# EAGLE schematic MicroMouse (EAGLE 8.4.3)
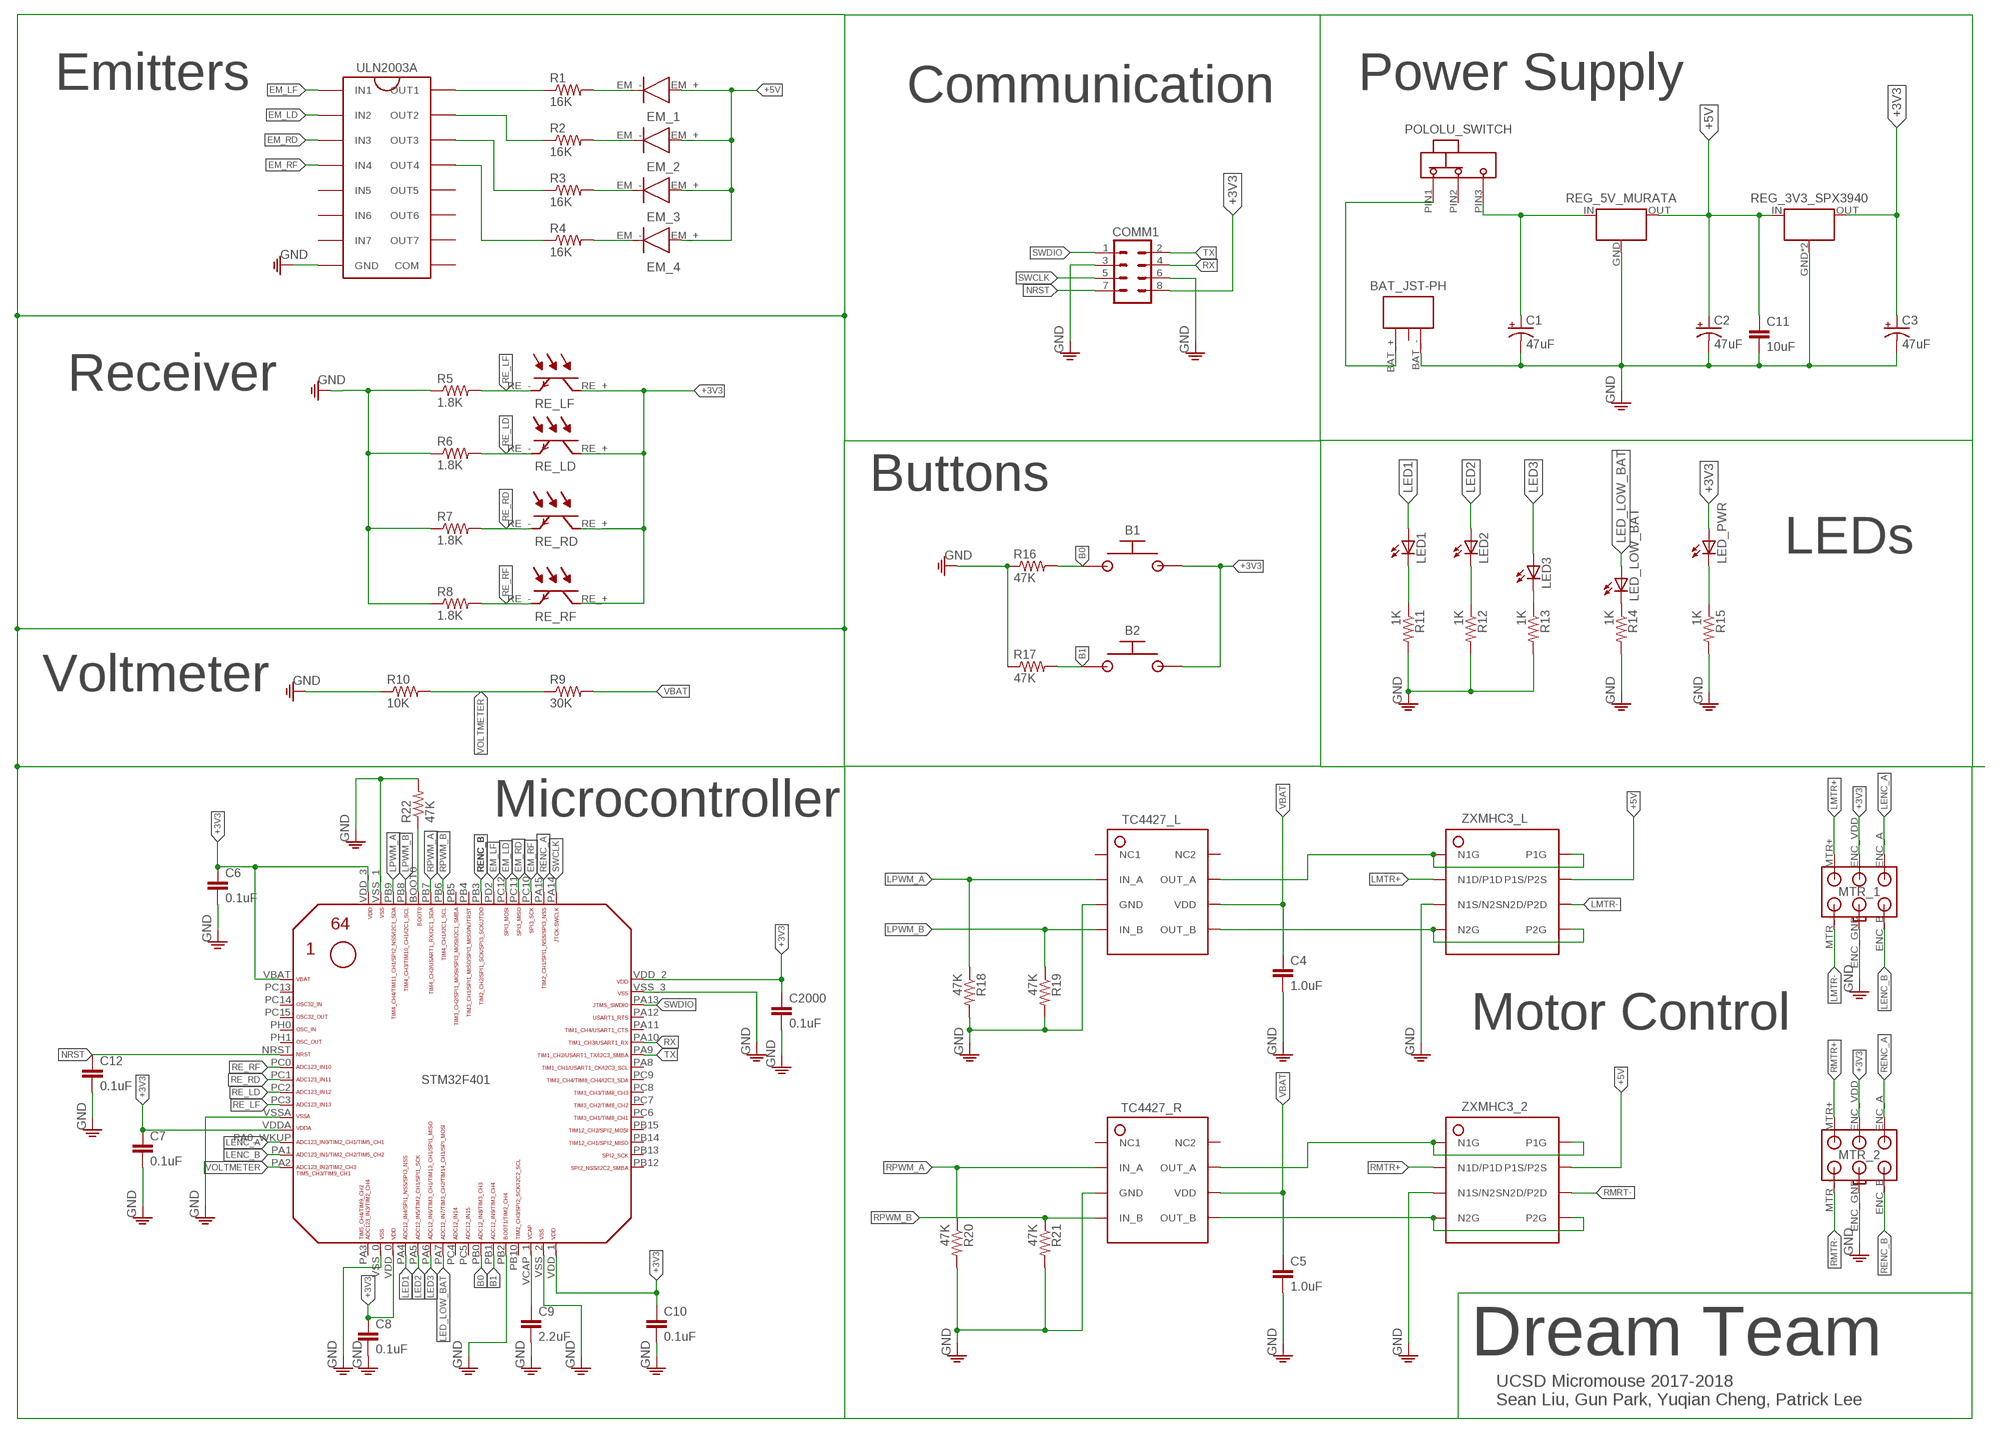
[diagram p0: schematic, sheet 1]

## Parts
B1  POLOLU_BUTTON  [POLOLU_BUTTON]
B2  POLOLU_BUTTON  [POLOLU_BUTTON]
BAT_JST-PH  3PIN  [B3B-PH-K-S]
C1  47uF  CAP_TANT_1210IN_3528MM  [CAP_TANT_1210IN_3528MM]
C2  47uF  CAP_TANT_1210IN_3528MM  [CAP_TANT_1210IN_3528MM]
C3  47uF  CAP_TANT_1210IN_3528MM  [CAP_TANT_1210IN_3528MM]
C4  1.0uF  CAP_CERAMIC_0805IN_2012MM  [0805]
C5  1.0uF  CAP_CERAMIC_0805IN_2012MM  [0805]
C6  0.1uF  CAP_CERAMIC_0805IN_2012MM  [0805]
C7  0.1uF  CAP_CERAMIC_0805IN_2012MM  [0805]
C8  0.1uF  CAP_CERAMIC_0805IN_2012MM  [0805]
C9  2.2uF  CAP_CERAMIC_0805IN_2012MM  [0805]
C10  0.1uF  CAP_CERAMIC_0805IN_2012MM  [0805]
C11  10uF  10UF-0805-10V-10%  [0805]
C12  0.1uF  CAP_CERAMIC_0805IN_2012MM  [0805]
C2000  0.1uF  CAP_CERAMIC_0805IN_2012MM  [0805]
COMM1  M04X2  [2X4]
EM_1  SFH4545  [EMITTER]
EM_2  SFH4545  [EMITTER]
EM_3  SFH4545  [EMITTER]
EM_4  SFH4545  [EMITTER]
LED1  LED  [LED-0805]
LED2  LED  [LED-0805]
LED3  LED  [LED-0805]
LED_LOW_BAT  LED  [LED-0805]
LED_PWR  LED  [LED-0805]
MTR_1  MOTOR_ENCODER_HEADER  [MOTOR_ENCODER_HEADER]
MTR_2  MOTOR_ENCODER_HEADER  [MOTOR_ENCODER_HEADER]
POLOLU_SWITCH  POLOLU_SWITCH  [POLOLU_SWITCH]
R1  16K  RESISTOR_0805IN_2012MM  [0805]
R2  16K  RESISTOR_0805IN_2012MM  [0805]
R3  16K  RESISTOR_0805IN_2012MM  [0805]
R4  16K  RESISTOR_0805IN_2012MM  [0805]
R5  1.8K  RESISTOR_0805IN_2012MM  [0805]
R6  1.8K  RESISTOR_0805IN_2012MM  [0805]
R7  1.8K  RESISTOR_0805IN_2012MM  [0805]
R8  1.8K  RESISTOR_0805IN_2012MM  [0805]
R9  30K  RESISTOR_0805IN_2012MM  [0805]
R10  10K  RESISTOR_0805IN_2012MM  [0805]
R11  1K  RESISTOR_0805IN_2012MM  [0805]
R12  1K  RESISTOR_0805IN_2012MM  [0805]
R13  1K  RESISTOR_0805IN_2012MM  [0805]
R14  1K  RESISTOR_0805IN_2012MM  [0805]
R15  1K  RESISTOR_0805IN_2012MM  [0805]
R16  47K  RESISTOR_0805IN_2012MM  [0805]
R17  47K  RESISTOR_0805IN_2012MM  [0805]
R18  47K  RESISTOR_0805IN_2012MM  [0805]
R19  47K  RESISTOR_0805IN_2012MM  [0805]
R20  47K  RESISTOR_0805IN_2012MM  [0805]
R21  47K  RESISTOR_0805IN_2012MM  [0805]
R22  47K  RESISTOR_0805IN_2012MM  [0805]
RE_LD  TEFT4300  [RECEIVER]
RE_LF  TEFT4300  [RECEIVER]
RE_RD  TEFT4300  [RECEIVER]
RE_RF  TEFT4300  [RECEIVER]
REG_3V3_SPX3940  3V3_REG  [SOT223]
REG_5V_MURATA  REG_5V_MURATA  [5V_REG_MURATA]
STM32F401  STM32F4_401_410_411_412_413_446  [LQFP64]
TC4427_L  TC4427_SOIC8  [TC4427_SOIC8]
TC4427_R  TC4427_SOIC8  [TC4427_SOIC8]
ULN2003A  ULN2003A  [ULN2003A]
ZXMHC3_2  ZXMHC3  [ZXMHC3]
ZXMHC3_L  ZXMHC3  [ZXMHC3]

## Nets
+3V3: B1.P$2 B2.P$2 C3.A(+) C6.1 C7.1 C8.1 C10.1 C2000.1 COMM1.8 LED_PWR.A MTR_1.ENC_VDD MTR_2.ENC_VDD RE_LD.RE_+(C) RE_LF.RE_+(C) RE_RD.RE_+(C) RE_RF.RE_+(C) REG_3V3_SPX3940.OUT STM32F401.VBAT STM32F401.VDD_0 STM32F401.VDD_1 STM32F401.VDD_2 STM32F401.VDD_3 STM32F401.VDDA
+5V: C2.A(+) C11.1 EM_1.EM_+(+) EM_2.EM_+(+) EM_3.EM_+(+) EM_4.EM_+(+) REG_3V3_SPX3940.IN REG_5V_MURATA.OUT ZXMHC3_2.P1S/P2S ZXMHC3_L.P1S/P2S
B0: B1.P$1 R16.2 STM32F401.PB0
B1: B2.P$1 R17.2 STM32F401.PB1
EM_LD: STM32F401.PC12 ULN2003A.2B(IN2)
EM_LF: STM32F401.PD2 ULN2003A.1B(IN1)
EM_RD: STM32F401.PC11 ULN2003A.3B(IN3)
EM_RF: STM32F401.PC10 ULN2003A.4B(IN4)
GND: BAT_JST-PH.BAT_- C1.C(-) C2.C(-) C3.C(-) C4.2 C5.2 C6.2 C7.2 C8.2 C9.2 C10.2 C11.2 C12.2 C2000.2 COMM1.3 COMM1.6 MTR_1.ENC_GND MTR_2.ENC_GND R5.1 R6.1 R7.1 R8.1 R10.1 R11.2 R12.2 R13.2 R14.2 R15.2 R16.1 R17.1 R18.2 R19.2 R20.2 R21.2 R22.2 REG_3V3_SPX3940.GND REG_3V3_SPX3940.GND2(GND) REG_5V_MURATA.GND STM32F401.PB2 STM32F401.VSS_1 STM32F401.VSSA TC4427_L.GND TC4427_R.GND ULN2003A.GND ZXMHC3_2.N1S/N2S ZXMHC3_L.N1S/N2S
LED1: LED1.A STM32F401.PA4
LED2: LED2.A STM32F401.PA5
LED3: LED3.A STM32F401.PA6
LED_LOW_BAT: LED_LOW_BAT.A STM32F401.PA7
LENC_A: MTR_1.ENC_A STM32F401.PA0_WKUP(PA0_AKUP)
LENC_B: MTR_1.ENC_B STM32F401.PA1
LMTR+: MTR_1.MTR+(MTR_+) ZXMHC3_L.N1D/P1D
LMTR-: MTR_1.MTR_- ZXMHC3_L.N2D/P2D
LPWM_A: R18.1 STM32F401.PB9 TC4427_L.IN_A
LPWM_B: R19.1 STM32F401.PB8 TC4427_L.IN_B
N$1: BAT_JST-PH.BAT_+ POLOLU_SWITCH.PIN1
N$3: C1.A(+) POLOLU_SWITCH.PIN3 REG_5V_MURATA.IN
N$4: LED1.C R11.1
N$5: LED2.C R12.1
N$6: LED3.C R13.1
N$7: R1.1 ULN2003A.1C(OUT1)
N$8: LED_LOW_BAT.C R14.1
N$9: R2.1 ULN2003A.2C(OUT2)
N$10: LED_PWR.C R15.1
N$11: R3.1 ULN2003A.3C(OUT3)
N$12: TC4427_L.OUT_A ZXMHC3_L.N1G ZXMHC3_L.P1G
N$13: R4.1 ULN2003A.4C(OUT4)
N$14: EM_1.EM_-(-) R1.2
N$15: TC4427_L.OUT_B ZXMHC3_L.N2G ZXMHC3_L.P2G
N$16: EM_2.EM_-(-) R2.2
N$17: EM_3.EM_-(-) R3.2
N$18: EM_4.EM_-(-) R4.2
N$21: TC4427_R.OUT_A ZXMHC3_2.N1G ZXMHC3_2.P1G
N$25: TC4427_R.OUT_B ZXMHC3_2.N2G ZXMHC3_2.P2G
N$28: C9.1 STM32F401.VCAP_1(PB11)
N$32: R22.1 STM32F401.BOOT0
NRST: C12.1 COMM1.7 STM32F401.NRST
RE_LD: R6.2 RE_LD.RE_-(E) STM32F401.PC2
RE_LF: R5.2 RE_LF.RE_-(E) STM32F401.PC3
RE_RD: R7.2 RE_RD.RE_-(E) STM32F401.PC1
RE_RF: R8.2 RE_RF.RE_-(E) STM32F401.PC0
RENC_A: MTR_2.ENC_A STM32F401.PA15
RENC_B: MTR_2.ENC_B STM32F401.PB3
RMRT-: ZXMHC3_2.N2D/P2D
RMTR+: MTR_2.MTR+(MTR_+) ZXMHC3_2.N1D/P1D
RMTR-: MTR_2.MTR_-
RPWM_A: R20.1 STM32F401.PB7 TC4427_R.IN_A
RPWM_B: R21.1 STM32F401.PB6 TC4427_R.IN_B
RX: COMM1.4 STM32F401.PA10
SWCLK: COMM1.5 STM32F401.PA14
SWDIO: COMM1.1 STM32F401.PA13
TX: COMM1.2 STM32F401.PA9
VBAT: C4.1 C5.1 R9.2 TC4427_L.VDD TC4427_R.VDD
VCAP_1: STM32F401.VSS_2(VCAP_1) ; supply symbol labelled GND
VCAP_2: STM32F401.VSS_3(VCAP_2) ; supply symbol labelled GND
VOLTMETER: R9.1 R10.2 STM32F401.PA2
VSS_0: STM32F401.VSS_0 ; supply symbol labelled GND
Unconnected: POLOLU_SWITCH.PIN2 STM32F401.PA3 STM32F401.PA8 STM32F401.PA11 STM32F401.PA12 STM32F401.PB4 STM32F401.PB5 STM32F401.PB10 STM32F401.PB12 STM32F401.PB13 STM32F401.PB14 STM32F401.PB15 STM32F401.PC4 STM32F401.PC5 STM32F401.PC6 STM32F401.PC7 STM32F401.PC8 STM32F401.PC9 STM32F401.PC13 STM32F401.PC14 STM32F401.PC15 STM32F401.PH0 STM32F401.PH1 TC4427_L.NC1 TC4427_L.NC2 TC4427_R.NC1 TC4427_R.NC2 ULN2003A.5B(IN5) ULN2003A.5C(OUT5) ULN2003A.6B(IN6) ULN2003A.6C(OUT6) ULN2003A.7B(IN7) ULN2003A.7C(OUT7) ULN2003A.COM

## Notes on the sheet
- Emitters | Communication | Power Supply
- Receiver
- Buttons
- LEDs
- Voltmeter
- Microcontroller
- Motor Control
- Dream Team
- UCSD Micromouse 2017-2018
  Sean Liu, Gun Park, Yuqian Cheng, Patrick Lee

## Library data of the parts
B1 B2 = POLOLU_BUTTON:POLOLU_BUTTON
BAT_JST-PH = BATT_JST-PH_3PIN:3PIN
C1-C3 = CAP_TANT_1210IN_3528MM:CAP_TANT_1210IN_3528MM
C4-C10 C12 C2000 = CAP_CERAMIC_0805IN_2012MM:CAP_CERAMIC_0805IN_2012MM
C11 = SparkFun-Capacitors:10UF: 10.0µF ceramic capacitors A capacitor is a passive two-terminal electrical component used to store electrical energy temporarily in an electric field.; PROD_ID: CAP-11330
COMM1 = 2X4_PIN_HEADER:M04X2
EM_1-EM_4 = SFH4545:SFH4545
LED1-LED3 LED_LOW_BAT LED_PWR = LED_0805:LED
MTR_1 MTR_2 = MOTOR_ENCODER_HEADER:MOTOR_ENCODER_HEADER
POLOLU_SWITCH = POLOLU_SWITCH:POLOLU_SWITCH
R1-R22 = RESISTOR_0805IN_2012MM:RESISTOR_0805IN_2012MM
RE_LD RE_LF RE_RD RE_RF = TEFT4300:TEFT4300
REG_3V3_SPX3940 = REG_3V3_LM3940:3V3_REG: 1A Low Dropout Regulator for 5V to 3.3V Conversion
REG_5V_MURATA = REG_5V_MURATA:REG_5V_MURATA
STM32F401 = STM32F4_401_410_411_412_413_446:STM32F4_401_410_411_412_413_446
TC4427_L TC4427_R = TC4427:TC4427_SOIC8
ULN2003A = ULN2003A:ULN2003A
ZXMHC3_2 ZXMHC3_L = ZXMHC3:ZXMHC3